# Altium schematic sheet 3V3.SchDoc
size A4
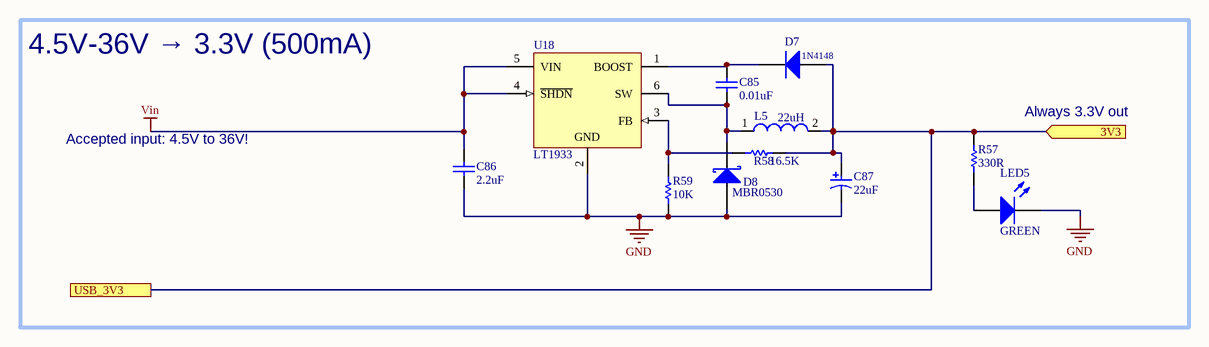
[diagram p0: 3V3.SchDoc]

## Parts
C85  0.01uF  [CAPC1608X87X35NL15T15]
C86  2.2uF  [CAPC2013X135X45ML10T25]
C87  22uF  [PNSC-EEE-FK1H220P_L]
D7  1N4148  [DIOD-SOD123-2_V]
D8  MBR0530  [FAIR-SOD123-2_V]
L5  22uH  [WE-PD-XL]
LED5  GREEN  [0603_A]
R57  330R  [RESC0603(1608)_L]
R58  16.5K  [RESC0603(1608)_L]
R59  10K  [RESC0603(1608)_L]
U18  LT1933  [LT-S6-6-SOT-23_L]

## Ports
3V3 (in), USB_3V3

## Nets
GND: C86.1 C87.2 D8.1(A) LED5.1(K) R59.1 U18.2(GND)
Vin: C86.2 U18.4(~{SHDN}) U18.5(VIN)
3V3: C87.1 D7.1(A) L5.2 R57.2 R58.1 ; port 3V3, port USB_3V3
NetC85_1: C85.1 D8.2(K) L5.1 U18.6(SW)
NetC85_2: C85.2 D7.2(K) U18.1(BOOST)
NetLED5_2: LED5.2(A) R57.1
NetR58_2: R58.2 R59.2 U18.3(FB)

## Notes on the sheet
- 4.5V-36V → 3.3V (500mA)
- Accepted input: 4.5V to 36V!
- Always 3.3V out

## Library data of the parts
C85 = CMP-2006-03308-1: 0.01uF 0603 50V; Manufacturer: Kemet; Part Number: C0603C101J5GACTU
C86 = CMP-2007-03522-1: Part Number: GRM21BF51E225ZA01L; Manufacturer: Murata
C87 = CMP-2000-06209-1: Cap Aluminum Lytic, 22 uF, +/- 20%, 6.3 to 100 V, -55 to 105 degC, 2-Pin SMD, RoHS, Tape and Reel; Manufacturer: Panasonic; Capacitance: 22µF; Rated Voltage: 50V; Lifetime@Temperature: 2000Hrs@105°C; Ripple Current: 165mA; Impedance: 0.88O; Type: Can; Operating Temp Range: -55to+105°C; Package Reference: EEE-FK1H220P; Case Size/Dimension: Ø6.3x5.8mm; Manufacturer URL: http://www.panasonic.com/; Datasheet URL: http://www.mouser.com/ds/2/315/ABA0000CE120-68386.pdf; Mounting Technology: SurfaceMount; Datasheet Version: 03/2014; Package Description: 2-Pin Aluminum Electrolytic Capacitor, Base 6.6 x 6.6 mm, Height 6.10 mm; Operating Temp-Max: 105°C; Series: FK
D7 = CMP-2000-04932-2: Fast Switching Diode, 100 V, 0.15 A, -65 to 150 degC, 2-Pin?SOD123, RoHS, Tape and Reel; Recovery Time: 4ns; Brand: DiodesIncorporated; Unit Weight: 0.000353oz; Max Surge Current: 2A; Peak Reverse Voltage: 100V; Ir - Reverse Current: 1uA; Vf - Forward Voltage: 1.25V; Configuration: Single; If - Forward Current: 0.15A; Product Category: Diodes-GeneralPurpose,Power,Switching; Operating Temperature Range: -65Cto+150C; Packaging: Reel; Manufacturer URL: http://www.diodes.com/; Maximum Operating Temperature: +150C; Height: 1.25mm; Minimum Operating Temperature: -65C; Product: SwitchingDiodes; Package URL: http://www.diodes.com/datasheets/ds18004.pdf; Type: SwitchingDiode; Package Reference: SOD123-2; Width: 1.7mm; Datasheet URL: http://www.farnell.com/datasheets/1915529.pdf; Datasheet Version: Rev. 24-2, 10/2013; Series: 1N4148; Factory Pack Quantity: 3000; Length: 2.85mm; RoHS: True; Manufacturer: DiodesIncorporated; Mounting Style: SMD/SMT; Package / Case: SOD-123
D8 = CMP-2000-05113-1: Diode Schottky 30V 0.5A 2-Pin SOD-123 T/R; Manufacturer: Fairchild; Speed: FastRecovery=200mA(Io); Voltage - Forward (Vf) (Max) @ If: 430mV@500mA; Online Catalog: SchottkyDiode; Current - Reverse Leakage @ Vr: 130µA@30V; Current - Average Rectified (Io): 500mA; Other Names: MBR0530CT; Reverse Recovery Time (trr): -; Category: DiscreteSemiconductorProducts; Package / Case: SOD-123; Capacitance @ Vr, F: -; Operating Temperature - Junction: -65degC~125degC; Standard Package: 1; Packaging: CutTape(CT); Family: Diodes,Rectifiers-Single; Diode Type: Schottky; Series: -; Datasheet Version: Rev. 1.1.0, 10/2014; Supplier Device Package: SOD-123; Mounting Type: SurfaceMount; Datasheet URL: https://www.fairchildsemi.com/datasheets/MB/MBR0530.pdf; Manufacturer URL: https://www.fairchildsemi.com/; Voltage - DC Reverse (Vr) (Max): 30V
L5 = CMP-0227-00204-1: SMD-Shielded Power Inductor WE-PD, L = 22.0 µH; Inductance: 22.0 ÂµH; PackageVersion: 2004; PackageDescription: SMD Inductor, 2-Leads, Body 12.0 x 12.0 mm; ComponentLink1URL: http://www.we-online.com; PackageReference: WE-PD-XL; ComponentLink1Description: Manufacturer Link; ComponentLink2Description: Datasheet; DatasheetVersion: ver 5, Oct-2004; ComponentLink2URL: http://www.we-online.de/katalog/media/pdf/744770122.pdf
LED5 = CMP-1426-00006-1: SMD mono-color Chip LED, WL-SMCW, Bright Green; PartNumber: 150060VS75000; Manufacturer: Wuerth Elektronik; ComponentLink2URL: http://katalog.we-online.com/led/datasheet/150060VS75000.pdf; ComponentLink1Description: Manufacturer URL; PackageReference: 0603_A; ComponentLink2Description: Datasheet; ComponentLink1URL: http://www.we-online.com; Color: Bright Green
R57 = CMP-1012-00062-1: 330R 0.1W 5% 0603 (1608 Metric)  SMD; Value: 330.00 Ohm; Case-EIA: 0603; Case-Metric: 1608; Tolerance: 5 %; Power: 0.1 W; Technology: SMT
R58 = CMP-1012-00062-1: 16.5K 0.1W 5% 0603 (1608 Metric)  SMD; Value: 16500Ohm; Case-EIA: 0603; Case-Metric: 1608; Tolerance: 5 %; Power: 0.1 W; Technology: SMT
R59 = CMP-1012-00062-1: 10K 0.1W 5% 0603 (1608 Metric)  SMD; Value: 10000 Ohm; Case-EIA: 0603; Case-Metric: 1608; Tolerance: 5 %; Power: 0.1 W; Technology: SMT
U18 = CMP-0491-01634-1: 600 mA, 500 kHz Step-Down Switching Regulator, 6-pin SOT23 (S6-6), -40 to 85 degC, Pb-Free, Tape and Reel; PartNumber: LT1933ES6#TRPBF; Manufacturer: Linear Technology; Number of Outputs: 1; Packing: Tape and Reel; ComponentLink3URL: http://cds.linear.com/docs/en/datasheet/175435f.pdf; ComponentLink1Description: Manufacturer URL; ComponentLink2Description: Datasheet; ComponentLink2URL: http://cds.linear.com/docs/en/datasheet/1933fe.pdf; Mounting Technology: Surface Mount; ComponentLink1URL: http://www.linear.com/; PackageVersion: Aug-07; PackageDescription: 6-Pin Plastic SOT-23, Body 1.625 x 2.9 mm, Pitch 0.95 mm; PackageReference: S6-6; DatasheetVersion: Rev. E; RoHS: TRUE; ComponentLink3Description: Package Specification